# Altium project ModbusValve.PrjPcb
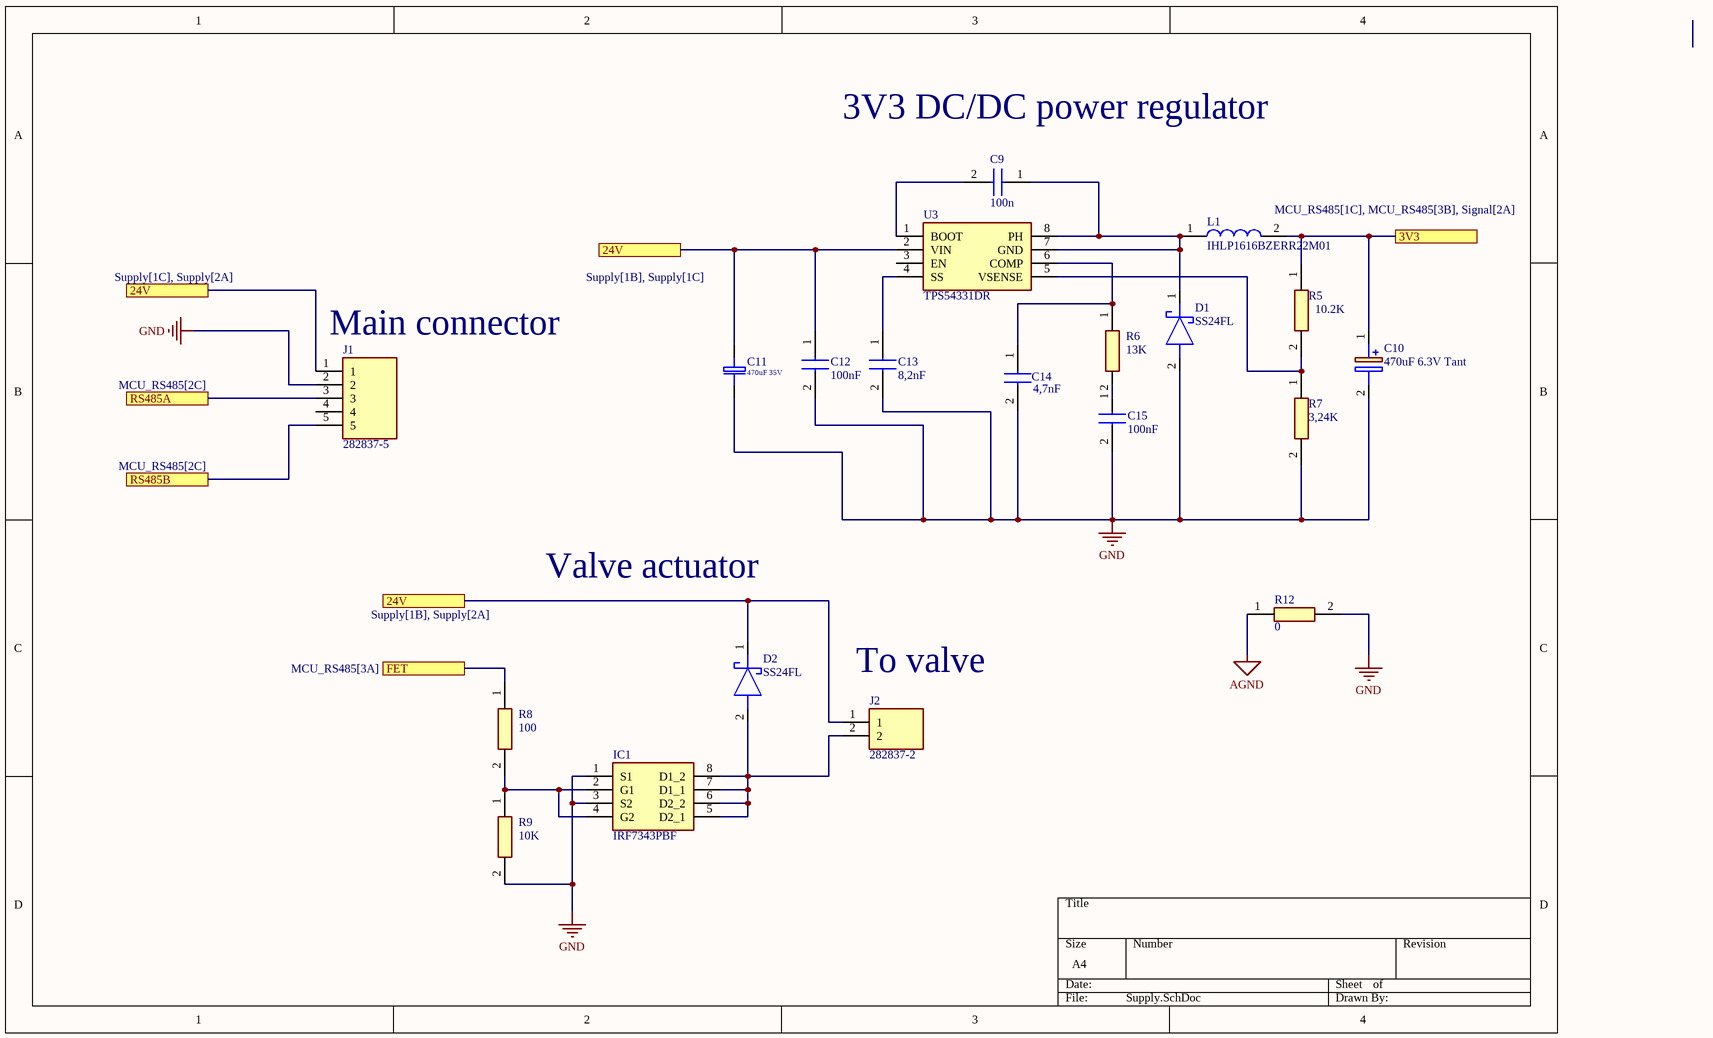
[diagram p0: Supply.SchDoc]
3 sheets, 47 parts. Net scope: flat (ports and power ports of the same name join across sheets).
Board file: PCB.PcbDoc
Sheets:
  Supply.SchDoc
  Signal.SchDoc
  MCU_RS485.SchDoc

## Sheet Supply.SchDoc
size A4; SheetNumber: 1; SheetTotal: 3

### Parts
C9  100n  [CAPC2012X94N]
C10  470uF 6.3V Tant  [CAPPM6032X280N]
C11  470uF 35V  [El-d8-h12-F3.81]
C12  100nF  [CAPC2012X94N]
C13  8,2nF  [CAPC2012X94N]
C14  4,7nF  [CAPC2012X94N]
C15  100nF  [CAPC2012X94N]
D1  SS24FL  [SODFL3617X108N]
D2  SS24FL  [SODFL3617X108N]
IC1  IRF7343PBF  [SOIC127P600X175-8N]
J1  282837-5  [2828375]
J2  282837-2  [2828372]
L1  IHLP1616BZERR22M01  [INDPM4441X200N]
R5  10.2K  [RESC2012X65N]
R6  13K  [RESC2012X65N]
R7  3,24K  [RESC2012X65N]
R8  100  [RESC2012X65N]
R9  10K  [RESC2012X65N]
R12  0  [RESC2012X65N]
U3  TPS54331DR  [SOIC127P600X175-8N]

### Ports
3V3 (see MCU_RS485[1C], MCU_RS485[3B], Signal[2A]), 24V (see Supply[1B], Supply[1C]), 24V (see Supply[1B], Supply[2A]), 24V (see Supply[1C], Supply[2A]), FET (see MCU_RS485[3A]), RS485A (see MCU_RS485[2C]), RS485B (see MCU_RS485[2C])

### Nets
AGND: R12.1
GND: C10.2(-) C11.2 C12.2 C13.2 C14.2 C15.2 D1.2(A) IC1.1(S1) IC1.3(S2) J1.2 R7.2 R9.2 R12.2
NetC1_1: C10.1(+) L1.2 R5.1 ; port 3V3
NetC9_1: C9.1 D1.1(K) L1.1 U3.7(GND) U3.8(PH)
NetC9_2: C9.2 U3.1(BOOT)
NetC11_1: C11.1 C12.1 D2.1(K) J1.1 J2.1 U3.2(VIN) ; port 24V
NetC13_1: C13.1 U3.4(SS)
NetC14_1: C14.1 R6.1 U3.6(COMP)
NetC15_1: C15.1 R6.2
NetD2_2: D2.2(A) IC1.5(D2_1) IC1.6(D2_2) IC1.7(D1_1) IC1.8(D1_2) J2.2
NetF1_2: J1.5 ; port RS485B
NetF2_2: J1.3 ; port RS485A
NetIC1_2: IC1.2(G1) IC1.4(G2) R8.2 R9.1
NetR5_2: R5.2 R7.1 U3.5(VSENSE)
NetR8_1: R8.1 ; port FET

Not connected (* = marked no-connect by the designer): J1 4; U3 3(EN)

### Notes on the sheet
- 3V3 DC/DC power regulator
- (near J1) Main connector
- Valve actuator
- (near J2) To valve

### Library data of the parts
C9 C12-C15 = 08055A471FAT4A: Capacitor; Manufacturer_Name: AVX; Datasheet Link: https://componentsearchengine.com/Datasheets/1/06031A100FAT2A.pdf; Height: 0.94mm; Manufacturer_Part_Number: 08055A471FAT4A; Mouser Part Number: 581-08055A471FAT4A; Mouser Price/Stock: https://www.mouser.com/Search/Refine.aspx?Keyword=581-08055A471FAT4A; Arrow Part Number: 08055A471FAT4A; Arrow Price/Stock: https://www.arrow.com/en/products/08055a471fat4a/avx
C10 = TAJC477K004RNJ: Capacitor Polarised; Manufacturer_Name: AVX; Datasheet Link: http://datasheets.avx.com/TAJ.pdf; Height: 2.8mm; Manufacturer_Part_Number: TAJC477K004RNJ; Mouser Part Number: 581-TAJC477K004RNJ; Mouser Price/Stock: https://www.mouser.com/Search/Refine.aspx?Keyword=581-TAJC477K004RNJ; Arrow Part Number: TAJC477K004RNJ; Arrow Price/Stock: https://www.arrow.com/en/products/tajc477k004rnj/avx
C11 = 100u-35V-105F: 35V-105F 0.5om 0.4A; Price: 0.07; Value: 470uF 35V
D1 D2 = SS24FL: Schottky Diode; Manufacturer_Name: onsemi; Datasheet Link: https://www.onsemi.com/pub/Collateral/SS26FL-D.PDF; Height: 1.08mm; Manufacturer_Part_Number: SS24FL; Mouser Part Number: 512-SS24FL; Mouser Price/Stock: https://www.mouser.co.uk/ProductDetail/onsemi-Fairchild/SS24FL?qs=tqW9UTzndZyvT5hdH%252BfSxg%3D%3D; Arrow Part Number: SS24FL; Arrow Price/Stock: https://www.arrow.com/en/products/ss24fl/on-semiconductor?region=europe
IC1 = IRF7343PBF: Integrated Circuit; Manufacturer_Name: Infineon; Datasheet Link: https://www.infineon.com/dgdl/irf7343pbf.pdf?fileId=5546d462533600a4015355f68c1a1b73; Height: 1.75mm; Manufacturer_Part_Number: IRF7343PBF; Mouser Part Number: 942-IRF7343PBF; Mouser Price/Stock: https://www.mouser.co.uk/ProductDetail/Infineon-IR/IRF7343PBF?qs=oV44URRYgr3BtQItr9FXKw%3D%3D; Arrow Part Number: IRF7343PBF; Arrow Price/Stock: https://www.arrow.com/en/products/irf7343pbf/infineon-technologies-ag
J1 = 282837-5: Connector; Manufacturer_Name: TE Connectivity; Datasheet Link: https://www.te.com/commerce/DocumentDelivery/DDEController?Action=srchrtrv&DocNm=282837&DocType=Customer+Drawing&DocLang=English; Height: 10.3mm; Manufacturer_Part_Number: 282837-5; Mouser Part Number: 571-2828375; Mouser Price/Stock: https://www.mouser.co.uk/ProductDetail/TE-Connectivity/282837-5?qs=A%252Bip%252BNCYi6MoalTIA9eyLA%3D%3D; Arrow Part Number: 282837-5; Arrow Price/Stock: https://www.arrow.com/en/products/282837-5/te-connectivity?region=nac
J2 = 282837-2: Connector; Manufacturer_Name: TE Connectivity; Datasheet Link: https://www.te.com/commerce/DocumentDelivery/DDEController?Action=srchrtrv&DocNm=282837&DocType=Customer+Drawing&DocLang=English&DocFormat=pdf&PartCntxt=282837-2; Height: 10.3mm; Manufacturer_Part_Number: 282837-2; Mouser Part Number: 571-2828372; Mouser Price/Stock: https://www.mouser.co.uk/ProductDetail/TE-Connectivity/282837-2?qs=A%252Bip%252BNCYi6O2H0NGWOeAxg%3D%3D; Arrow Part Number: 282837-2; Arrow Price/Stock: https://www.arrow.com/en/products/282837-2/te-connectivity?region=europe
L1 = IHLP1616BZERR22M01: Inductor; Manufacturer_Name: Vishay; Datasheet Link: https://datasheet.datasheetarchive.com/originals/distributors/Datasheets-DGA11/2193884.pdf; Height: 2mm; Manufacturer_Part_Number: IHLP1616BZERR22M01; Mouser Part Number: 70-IHLP1616BZERR22M0; Mouser Price/Stock: https://www.mouser.co.uk/ProductDetail/Vishay-Dale/IHLP1616BZERR22M01?qs=UUKq9QDXQ0nvzHiHJuJb2g%3D%3D; Arrow Part Number: IHLP1616BZERR22M01; Arrow Price/Stock: https://www.arrow.com/en/products/ihlp1616bzerr22m01/vishay
R5-R9 R12 = CPF0805B102KE1: Resistor; Manufacturer_Name: TE Connectivity; Datasheet Link: http://docs-europe.electrocomponents.com/webdocs/13d1/0900766b813d116f.pdf; Height: 0.65mm; Manufacturer_Part_Number: CPF0805B102KE1; Mouser Part Number: 279-CPF0805B102KE1; Mouser Price/Stock: https://www.mouser.com/Search/Refine.aspx?Keyword=279-CPF0805B102KE1
U3 = TPS54331D: Integrated Circuit; Manufacturer_Name: Texas Instruments; Datasheet Link: http://www.ti.com/lit/gpn/tps54331; Height: 1.75mm; Manufacturer_Part_Number: TPS54331D; Mouser Part Number: 595-TPS54331D; Mouser Price/Stock: https://www.mouser.co.uk/ProductDetail/Texas-Instruments/TPS54331D?qs=QyYHynRG50pEbpiybdzwkw%3D%3D; Arrow Part Number: TPS54331D; Arrow Price/Stock: https://www.arrow.com/en/products/tps54331d/texas-instruments?region=nac

## Sheet Signal.SchDoc
size A4; SheetNumber: 2; SheetTotal: 3
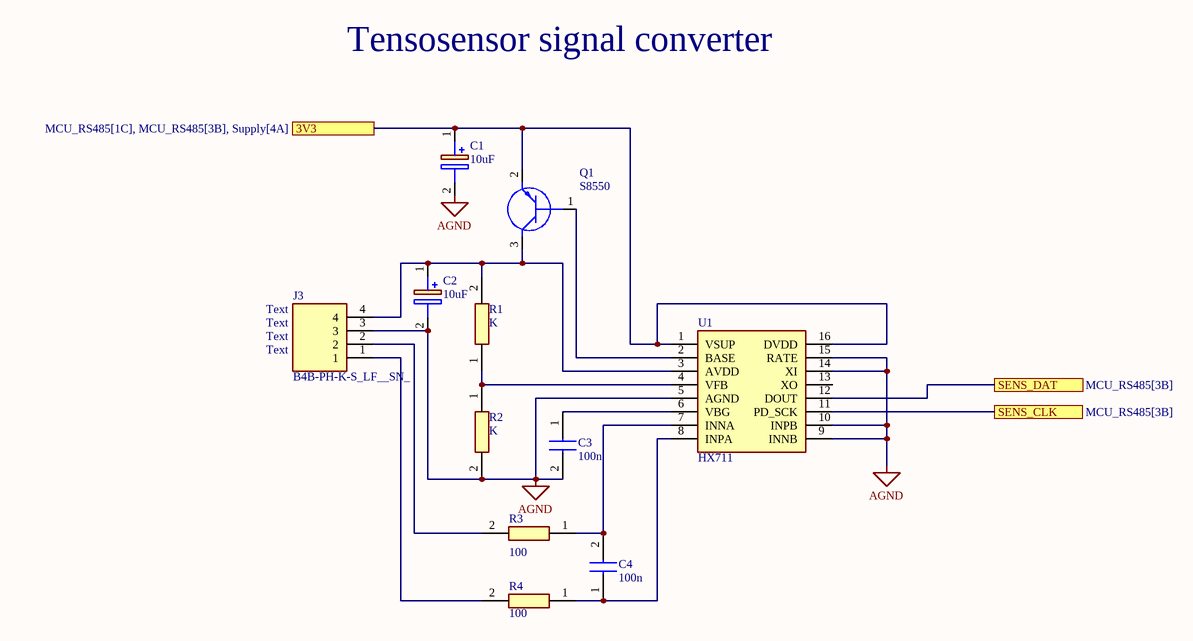
[diagram p1: Signal.SchDoc]

### Parts
C1  10uF  [CAPPM3216X180N]
C2  10uF  [CAPPM3216X180N]
C3  100n  [CAPC2012X94N]
C4  100n  [CAPC2012X94N]
J3  B4B-PH-K-S_LF__SN_  [SHDR4W50P0X200_1X4_990X450X600P]
Q1  S8550  [SOT95P240X110-3N]
R1  K  [RESC2012X65N]
R2  K  [RESC2012X65N]
R3  100  [RESC2012X65N]
R4  100  [RESC2012X65N]
U1  HX711  [SOIC127P600X160-16N]

### Ports
3V3 (see MCU_RS485[1C], MCU_RS485[3B], Supply[4A]), SENS_CLK (see MCU_RS485[3B]), SENS_DAT (see MCU_RS485[3B])

### Nets
AGND: C1.2(-) C2.2(-) C3.2 J3.3 R2.2 U1.5(AGND) U1.9(INNB) U1.10(INPB) U1.14(XI) U1.15(RATE)
NetC1_1: C1.1(+) Q1.2(E) U1.1(VSUP) U1.16(DVDD) ; port 3V3
NetC2_1: C2.1(+) J3.4 Q1.3(C) R1.2 U1.3(AVDD)
NetC3_1: C3.1 U1.6(VBG)
NetC4_1: C4.1 R4.1 U1.8(INPA)
NetC4_2: C4.2 R3.1 U1.7(INNA)
NetJ3_1: J3.1 R4.2
NetJ3_2: J3.2 R3.2
NetQ1_1: Q1.1(B) U1.2(BASE)
NetR1_1: R1.1 R2.1 U1.4(VFB)
NetU1_11: U1.11(PD_SCK) ; port SENS_CLK
NetU1_12: U1.12(DOUT) ; port SENS_DAT

Not connected (* = marked no-connect by the designer): U1 13(XO)

### Notes on the sheet
- Tensosensor signal converter
- Text

### Library data of the parts
C1 C2 = 293D105X9016AW2E3: Capacitor Polarised; Manufacturer_Name: Vishay; Datasheet Link: http://www.vishay.com/docs/40002/293d.pdf; Height: 1.8mm; Manufacturer_Part_Number: 293D105X9016AW2E3
C3 C4 = 08055A471FAT4A: Capacitor; Manufacturer_Name: AVX; Datasheet Link: https://componentsearchengine.com/Datasheets/1/06031A100FAT2A.pdf; Height: 0.94mm; Manufacturer_Part_Number: 08055A471FAT4A; Mouser Part Number: 581-08055A471FAT4A; Mouser Price/Stock: https://www.mouser.com/Search/Refine.aspx?Keyword=581-08055A471FAT4A; Arrow Part Number: 08055A471FAT4A; Arrow Price/Stock: https://www.arrow.com/en/products/08055a471fat4a/avx
J3 = B4B-PH-K-S_LF__SN_: Connector; Manufacturer_Name: JST (JAPAN SOLDERLESS TERMINALS); Manufacturer_Part_Number: B4B-PH-K-S(LF)(SN); Datasheet Link: https://datasheet.lcsc.com/szlcsc/JST-Sales-America-B4B-PH-K-S-LF-SN_C131334.pdf; Height: 6mm; Arrow Part Number: B4B-PH-K-S(LF)(SN); Arrow Price/Stock: https://www.arrow.com/en/products/b4b-ph-k-s-lf-sn/jst-manufacturing?region=europe
Q1 = S8550: Transistor BJT PNP; Manufacturer_Name: Galaxy; Datasheet Link: https://datasheet.datasheetarchive.com/originals/distributors/Datasheets-3/DSA-49109.pdf; Height: 1.1mm; Manufacturer_Part_Number: S8550
R1-R4 = CPF0805B102KE1: as R5 on sheet Supply; Datasheet Link: http://docs-europe.electrocomponents.com/webdocs/13d1/0900766b813d116f.pdf; Height: 0.65mm; Manufacturer_Part_Number: CPF0805B102KE1; Mouser Part Number: 279-CPF0805B102KE1; Mouser Price/Stock: https://www.mouser.com/Search/Refine.aspx?Keyword=279-CPF0805B102KE1
U1 = HX711: Integrated Circuit; Manufacturer_Name: AVIA; Datasheet Link: https://cdn.sparkfun.com/datasheets/Sensors/ForceFlex/hx711_english.pdf; Height: 1.6mm; Manufacturer_Part_Number: HX711

## Sheet MCU_RS485.SchDoc
size A4; SheetNumber: 3; SheetTotal: 3
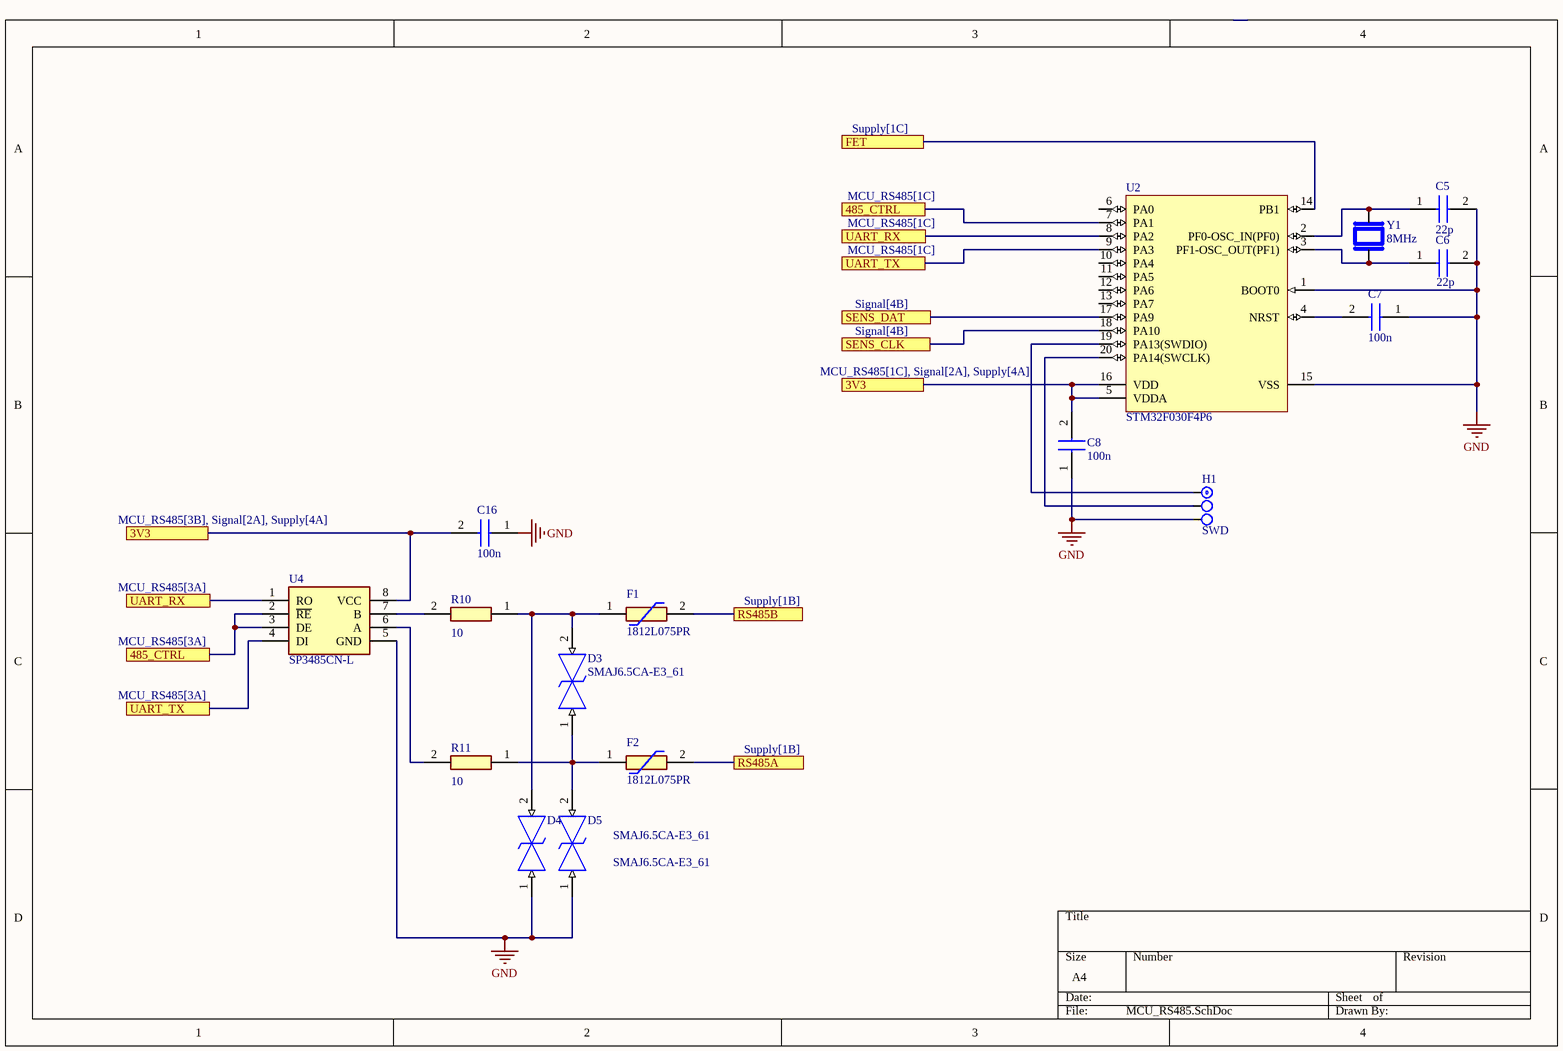
[diagram p2: MCU_RS485.SchDoc]

### Parts
C5  22p  [CAPC2012X94N]
C6  22p  [CAPC2012X94N]
C7  100n  [CAPC2012X94N]
C8  100n  [CAPC2012X94N]
C16  100n  [CAPC2012X94N]
D3  SMAJ6.5CA-E3_61  [DIONM5127X229N]
D4  SMAJ6.5CA-E3_61  [DIONM5127X229N]
D5  SMAJ6.5CA-E3_61  [DIONM5127X229N]
F1  1812L075PR  [1812L010DR]
F2  1812L075PR  [1812L010DR]
H1  SWD  [J1x3]
R10  10  [RESC2012X65N]
R11  10  [RESC2012X65N]
U2  STM32F030F4P6  [STM-TSSOP20_L]
U4  SP3485CN-L  [SOIC127P600X175-8N]
Y1  8MHz  [XTAL_ABM3-14.7456MHZ-D2Y-T]

### Ports
3V3 (see MCU_RS485[1C], Signal[2A], Supply[4A]), 3V3 (see MCU_RS485[3B], Signal[2A], Supply[4A]), 485_CTRL (see MCU_RS485[1C]), 485_CTRL (see MCU_RS485[3A]), FET (see Supply[1C]), RS485A (see Supply[1B]), RS485B (see Supply[1B]), SENS_CLK (see Signal[4B]), SENS_DAT (see Signal[4B]), UART_RX (see MCU_RS485[1C]), UART_RX (see MCU_RS485[3A]), UART_TX (see MCU_RS485[1C]), UART_TX (see MCU_RS485[3A])

### Nets
GND: C5.2 C6.2 C7.1 C8.1 C16.1 D4.1 D5.1 H1.3 U2.1(BOOT0) U2.15(VSS) U4.5(GND)
NetC1_1: C8.2 C16.2 U2.5(VDDA) U2.16(VDD) U4.8(VCC) ; port 3V3
NetC5_1: C5.1 U2.2(PF0-OSC_IN(PF0)) Y1.2
NetC6_1: C6.1 U2.3(PF1-OSC_OUT(PF1)) Y1.1
NetC7_2: C7.2 U2.4(NRST)
NetD3_1: D3.1 D5.2 F2.1 R11.1
NetD3_2: D3.2 D4.2 F1.1 R10.1
NetF1_2: F1.2 ; port RS485B
NetF2_2: F2.2 ; port RS485A
NetH1_1: H1.1 U2.19(PA13(SWDIO))
NetH1_2: H1.2 U2.20(PA14(SWCLK))
NetR8_1: U2.14(PB1) ; port FET
NetR10_2: R10.2 U4.7(B)
NetR11_2: R11.2 U4.6(A)
NetU1_11: U2.18(PA10) ; port SENS_CLK
NetU1_12: U2.17(PA9) ; port SENS_DAT
NetU2_7: U2.7(PA1) U4.2(~{RE}) U4.3(DE) ; port 485_CTRL
NetU2_8: U2.8(PA2) U4.1(RO) ; port UART_RX
NetU2_9: U2.9(PA3) U4.4(DI) ; port UART_TX

Not connected (* = marked no-connect by the designer): U2 6(PA0) 10(PA4) 11(PA5) 12(PA6) 13(PA7)

### Library data of the parts
C5-C8 C16 = 08055A471FAT4A: Capacitor; Manufacturer_Name: AVX; Datasheet Link: https://componentsearchengine.com/Datasheets/1/06031A100FAT2A.pdf; Height: 0.94mm; Manufacturer_Part_Number: 08055A471FAT4A; Mouser Part Number: 581-08055A471FAT4A; Mouser Price/Stock: https://www.mouser.com/Search/Refine.aspx?Keyword=581-08055A471FAT4A; Arrow Part Number: 08055A471FAT4A; Arrow Price/Stock: https://www.arrow.com/en/products/08055a471fat4a/avx
D3-D5 = SMAJ6.5CA-E3_61: TVS Diode (Bi-directional); Manufacturer_Name: Vishay; Manufacturer_Part_Number: SMAJ6.5CA-E3/61; Datasheet Link: https://componentsearchengine.com/Datasheets/2/SMAJ6.5CA-E3_61.pdf; Height: 2.29mm; Mouser Part Number: 625-SMAJ6.5CA-E3; Mouser Price/Stock: https://www.mouser.co.uk/ProductDetail/Vishay-General-Semiconductor/SMAJ65CA-E3-61?qs=M2MvrwIlMUyD6pU3Wy9iEA%3D%3D; Arrow Part Number: SMAJ6.5CA-E3/61; Arrow Price/Stock: https://www.arrow.com/en/products/smaj6.5ca-e361/vishay?region=nac
F1 F2 = 1812L075PR: Resettable Fuse; Manufacturer_Name: LITTELFUSE; Datasheet Link: http://www.littelfuse.com/~/media/electronics/datasheets/resettable_ptcs/littelfuse_ptc_1812l_datasheet.pdf.pdf; Height: 1.25mm; Manufacturer_Part_Number: 1812L075PR; Mouser Part Number: 576-1812L075PR; Mouser Price/Stock: https://www.mouser.co.uk/ProductDetail/Littelfuse/1812L075PR?qs=PWhpLWeW8weuCGexZfyXng%3D%3D; Arrow Part Number: 1812L075PR; Arrow Price/Stock: https://www.arrow.com/en/products/1812l075pr/littelfuse?region=nac
H1 = H-1x3: Price: 0.03
R10 R11 = CPF0805B102KE1: as R5 on sheet Supply; Datasheet Link: http://docs-europe.electrocomponents.com/webdocs/13d1/0900766b813d116f.pdf; Height: 0.65mm; Manufacturer_Part_Number: CPF0805B102KE1; Mouser Part Number: 279-CPF0805B102KE1; Mouser Price/Stock: https://www.mouser.com/Search/Refine.aspx?Keyword=279-CPF0805B102KE1
U2 = STM32F030F4P6: ARM Cortex-M0 32-bit MCU, 16 KB Flash, 4 KB Internal RAM, 15 I/Os, 20-pin TSSOP, -40 to 85 degC, Tube; FLASH Size (Prog) (kB): 16; I/Os (High Current): 15; Internal RAM Size (kB): 4; Operating Frequency(F) (Processor speed) (MHz): 48; Supply Voltage(Vcc) min (V): 2.4; DatasheetVersion: Rev. 1; PackageVersion: Rev. 1, 11/2012; PackageReference: TSSOP20; PackageDescription: 20-Pin Thin Shrink Small Outline Package, 6.5 x 4.4 mm Body, 0.65 mm Pitch; Supplier 1: Digi-Key; Supplier Part Number 1: 497-14044-5-ND; Supplier 2: Newark; Supplier Part Number 2: 06X3648; Supplier 3: Mouser; Supplier Part Number 3: 511-STM32F030F4P6; Core: ARM Cortex-M0; Packing: Tube; Mounting Technology: Surface Mount; PartNumber: STM32F030F4P6; ComponentLink1Description: Manufacturer URL; ComponentLink1URL: http://www.st.com/web/en/home.html; ComponentLink2Description: Datasheet; ComponentLink2URL: http://www.st.com/st-web-ui/static/active/en/resource/technical/document/datasheet/DM00088500.pdf; ComponentLink3Description: Package Specification; ComponentLink3URL: http://www.st.com/st-web-ui/static/active/en/resource/technical/document/datasheet/DM00065136.pdf
U4 = SP3485CN-L: Integrated Circuit; Manufacturer_Name: EXAR; Datasheet Link: https://datasheet.datasheetarchive.com/originals/distributors/Datasheets-DGA14/1190127.pdf; Height: 1.75mm; Manufacturer_Part_Number: SP3485CN-L; Mouser Part Number: 701-SP3485CN-L; Mouser Price/Stock: https://www.mouser.com/Search/Refine.aspx?Keyword=701-SP3485CN-L; Arrow Part Number: SP3485CN-L; Arrow Price/Stock: https://www.arrow.com/en/products/sp3485cn-l/exar
Y1 = ABM3-14.7456MHZ-D2Y-T: Ceramic SMD Crystal; MF: Abracon; Package: SMD-2 Abracon; SnapEDA_Link: https://www.snapeda.com/parts/ABM3-14.7456MHZ-D2Y-T/Abracon+LLC/view-part/?ref=snap; MP: ABM3-14.7456MHZ-D2Y-T; Value: *; Availability: In Stock; Price: None; Purchase-URL: https://pricing.snapeda.com/search/part/ABM3-14.7456MHZ-D2Y-T/?ref=eda; Check_prices: https://www.snapeda.com/parts/ABM3-14.7456MHZ-D2Y-T/Abracon+LLC/view-part/?ref=eda

## Nets that join several sheets
AGND: Supply (R12.1), Signal (10 pins)
GND: Supply (13 pins), MCU_RS485 (11 pins)
NetC1_1: Supply (C10.1 L1.2 R5.1), Signal (C1.1 Q1.2 U1.1 U1.16), MCU_RS485 (5 pins)
NetF1_2: Supply (J1.5), MCU_RS485 (F1.2)
NetF2_2: Supply (J1.3), MCU_RS485 (F2.2)
NetR8_1: Supply (R8.1), MCU_RS485 (U2.14)
NetU1_11: Signal (U1.11), MCU_RS485 (U2.18)
NetU1_12: Signal (U1.12), MCU_RS485 (U2.17)